# Altium schematic sheet TLS_PWR.SchDoc
size A4
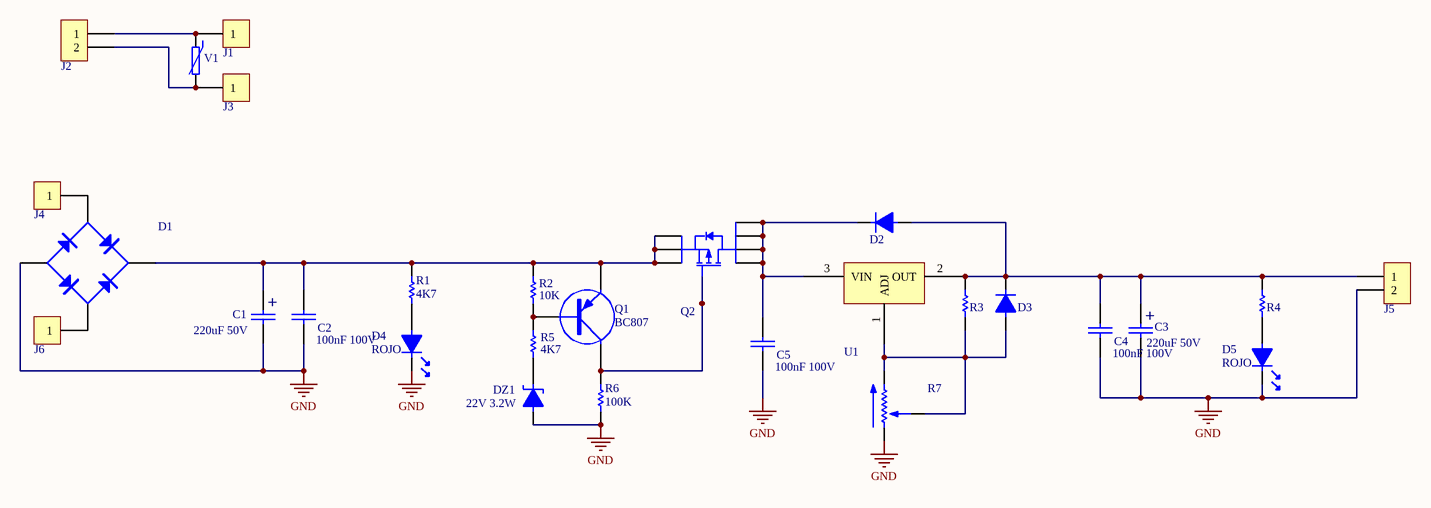
[diagram p0: TLS_PWR.SchDoc]

## Parts
C1  220uF 50V  [CAP500RP]
C2  100nF 100V  [0603]
C3  220uF 50V  [CAP500RP]
C4  100nF 100V  [0603]
C5  100nF 100V  [0603]
D1  CD-MBL210S  [CD-MBL210S]  (value not drawn)
D2  S1M  [SMAK]  (value not drawn)
D3  S1M  [SMAK]  (value not drawn)
D4  ROJO  [LED0603_R]
D5  ROJO  [LED0603_R]
DZ1  22V 3.2W  [DO-216AA]
J1  PIN CABLE  [PIN_CABLE]  (value not drawn)  (no BOM)
J2  BORNERA CON TORNILLO  [BORNERA2]  (value not drawn)
J3  PIN CABLE  [PIN_CABLE]  (value not drawn)  (no BOM)
J4  PIN CABLE  [PIN_CABLE]  (value not drawn)  (no BOM)
J5  BORNERA CON TORNILLO  [BORNERA2]  (value not drawn)
J6  PIN CABLE  [PIN_CABLE]  (value not drawn)  (no BOM)
Q1  BC807  [SOT23]
Q2  IRF7240  [SOIC8]  (value not drawn)
R1  4K7  [0603]
R2  10K  [0603]
R3  220R  [0603]  (value not drawn)
R4  1K  [0603]  (value not drawn)
R5  4K7  [0603]
R6  100K  [0603]
R7  10K  [3296W]  (value not drawn)
U1  LM317  [D2PAK]  (value not drawn)
V1  250V  [VARTH_20]  (value not drawn)

## Nets
GND: C1.2 C2.2 C3.2 C4.2 C5.2 D1.3(V-) D4.2 D5.2 DZ1.1 J5.2 R6.2 R7.1(CCW)
NetC1_1: C1.1 C2.1 D1.1(V+) Q1.3(E) Q2.1(S) Q2.2(S) Q2.3(S) R1.2 R2.2
NetC3_1: C3.1 C4.1 D2.1 D3.2 J5.1 R3.2 R4.2 U1.2(OUT)
NetC5_1: C5.1 D2.2 Q2.5(D) Q2.6(D) Q2.7(D) Q2.8(D) U1.3(VIN)
NetD1_2: D1.2(AC) J4.1
NetD1_4: D1.4(AC) J6.1
NetD3_1: D3.1 R3.1 R7.2(WIPER) R7.3(CW) U1.1(ADJ)
NetD4_1: D4.1 R1.1
NetD5_1: D5.1 R4.1
NetDZ1_2: DZ1.2 R5.1
NetJ1_1: J1.1 J2.1 V1.1
NetJ2_2: J2.2 J3.1 V1.2
NetQ1_1: Q1.1(B) R2.1 R5.2
NetQ1_2: Q1.2(C) Q2.4(G) R6.1

## Notes on the sheet
- (in symbol CAP_ELECT_220uF_50V) +

## Library data of the parts
C1 C3 = CAP_ELECT_220uF_50V: CAP ELECT 220uF 50V; Manufacturer: Nichicon; Manufacturer Part Number: UHE1H221MPD; CREO: JP; Part Number: CAP_ELECT_220uF_50V; Value: 220uF 50V; Supplier 1: Digi-Key; Supplier Part Number 1: 493-1609-ND; APROBO: -
C2 C4 C5 = CAP0603_100nF_100V_X7R: CAP0603 100nF 100V X7R; Manufacturer: Yageo; Manufacturer Part Number: CC0603KRX7R0BB104; CREO: MM; Part Number: CAP0603_100nF_100V_X7R; Value: 100nF 100V; Supplier 1: Digi-Key; Supplier Part Number 1: 311-1523-1-ND
D1 = CD-MBL210S: BRIDGE RECT 1PHASE 1KV 2A; Manufacturer: Bourns Inc.; CREO: JP; Part Number: CD-MBL210S; Value: CD-MBL210S; Manufacturer Part Number: CD-MBL210S; Supplier 1: Digi-Key; Supplier Part Number 1: CD-MBL210SCT-ND
D2 D3 = DIO_GEN_PURPOSE_S1M_SMA: DIODE GEN PURPOSE 1000V 1A SMAA; CREO: EB; Part Number: DIO_GEN_PURPOSE_S1M_SMA; Value: S1M; Supplier 1: Digi-Key; Supplier Part Number 1: S1MFSCT-ND
D4 D5 = LED0603_ROJO: LED ROJO 0603; Manufacturer: Lite-On Inc.; Manufacturer Part Number: LTST-C193KRKT-2A; CREO: EB; Part Number: LED0603_ROJO; Value: ROJO; Supplier 1: Digi-Key; Supplier Part Number 1: 160-1909-1-ND
DZ1 = DIO_ZEN_22V_DO-216AA: DIODE ZENER 22V 3.2W POWERMITE; Manufacturer: ON Semiconductor; Manufacturer Part Number: 1PMT5933BT1G; CREO: MM; Part Number: DIO_ZEN_22V_DO-216AA; Value: 22V 3.2W; Supplier 1: Digi-Key; Supplier Part Number 1: 1PMT5933BT1GOSTR-ND
J1 J3 J4 J6 = PIN_1_CABLE_1mm: PIN PARA SOLDAR CABLE 1MM; Publico: EB; Part Number: PIN_1_CABLE_1mm; Value: PIN CABLE; Aprobo: -
J2 J5 = BORNERA2_5mm_TORNILLO: BORNERA CON TORNILLO PASO 5mm (2 CONTACTOS); Publico: EB; Part Number: BORNERA2_5mm_TORNILLO; Value: BORNERA CON TORNILLO; Supplier 1: ElectroComponentes; Aprobo: -
Q1 = BC807_SOT23: TRANSISTOR PNP 500MA 45V SOT323; Publico: EB; Part Number: BC807_SOT23; Value: BC807; Supplier 1: Digi-Key; Supplier Part Number 1: BC80740MTFCT-ND; Aprobo: -
Q2 = IRF7240_SO8: Fet IRF7240; Publico: Carlos P; Part Number: IRF7240_SO8; Value: IRF7240; Aprobo: -
R1 R5 = RES0603_4K7_5%: RES0603 4K7 5%; Publico: EB; Part Number: RES0603_4K7_5%; Value: 4K7; Supplier 1: Digi-Key; Supplier Part Number 1: RMCF0603JT4K70CT-ND; Aprobo: -
R2 = RES0603_10K_5%: RES0603 10K 5%; Publico: EB; Part Number: RES0603_10K_5%; Value: 10K; Supplier 1: Digi-Key; Supplier Part Number 1: RMCF0603JT10K0CT-ND; Aprobo: -
R3 = RES0603_220R_5%: RES0603 220R 5%; Publico: EB; Part Number: RES0603_220R_5%; Value: 220R; Supplier 1: Digi-Key; Supplier Part Number 1: RMCF0603JT220RCT-ND; Aprobo: -
R4 = RES0603_1K_5%: RES0603 1K 5%; Publico: EB; Part Number: RES0603_1K_5%; Value: 1K; Supplier 1: Digi-Key; Supplier Part Number 1: RMCF0603JT1K00CT-ND; Aprobo: -
R6 = RES0603_100K_5%: RES0603 100K 5%; Publico: EB; Part Number: RES0603_100K_5%; Value: 100K; Supplier 1: Digi-Key; Supplier Part Number 1: RMCF0603JT100KCT-ND; Aprobo: -
R7 = TRIMMER_3296W_10K: 3296W TRIMMER 10K OHM 0.5W PC PIN; Manufacturer: Bourns Inc.; Manufacturer Part Number: 3296W-1-103LF; Publico: JP; Part Number: TRIMMER_3296W_10K; Value: 10K; Supplier 1: Digi-Key; Supplier Part Number 1: 3296W-103LF-ND
U1 = LM317_D2PAK: IC REG LIN POS ADJ 1.5A D2PAK-3; Manufacturer: onsemi; Manufacturer Part Number: LM317D2TR4G; Publico: JP; Part Number: LM317_D2PAK; Value: LM317; Supplier 1: Digi-Key; Supplier Part Number 1: LM317D2TR4GOSCT-ND
V1 = VARTH_250V: VARISTOR 390V 10KA DISC 20MM; Manufacturer: TDK Electronics Inc.; Manufacturer Part Number: B72220S2251K101; CREO: MM; Part Number: VARTH_250V; Value: 250V; Supplier 1: Digi-Key; Supplier Part Number 1: 495-1447-ND